# EAGLE design tc4-controller-02 (EAGLE 5.10)
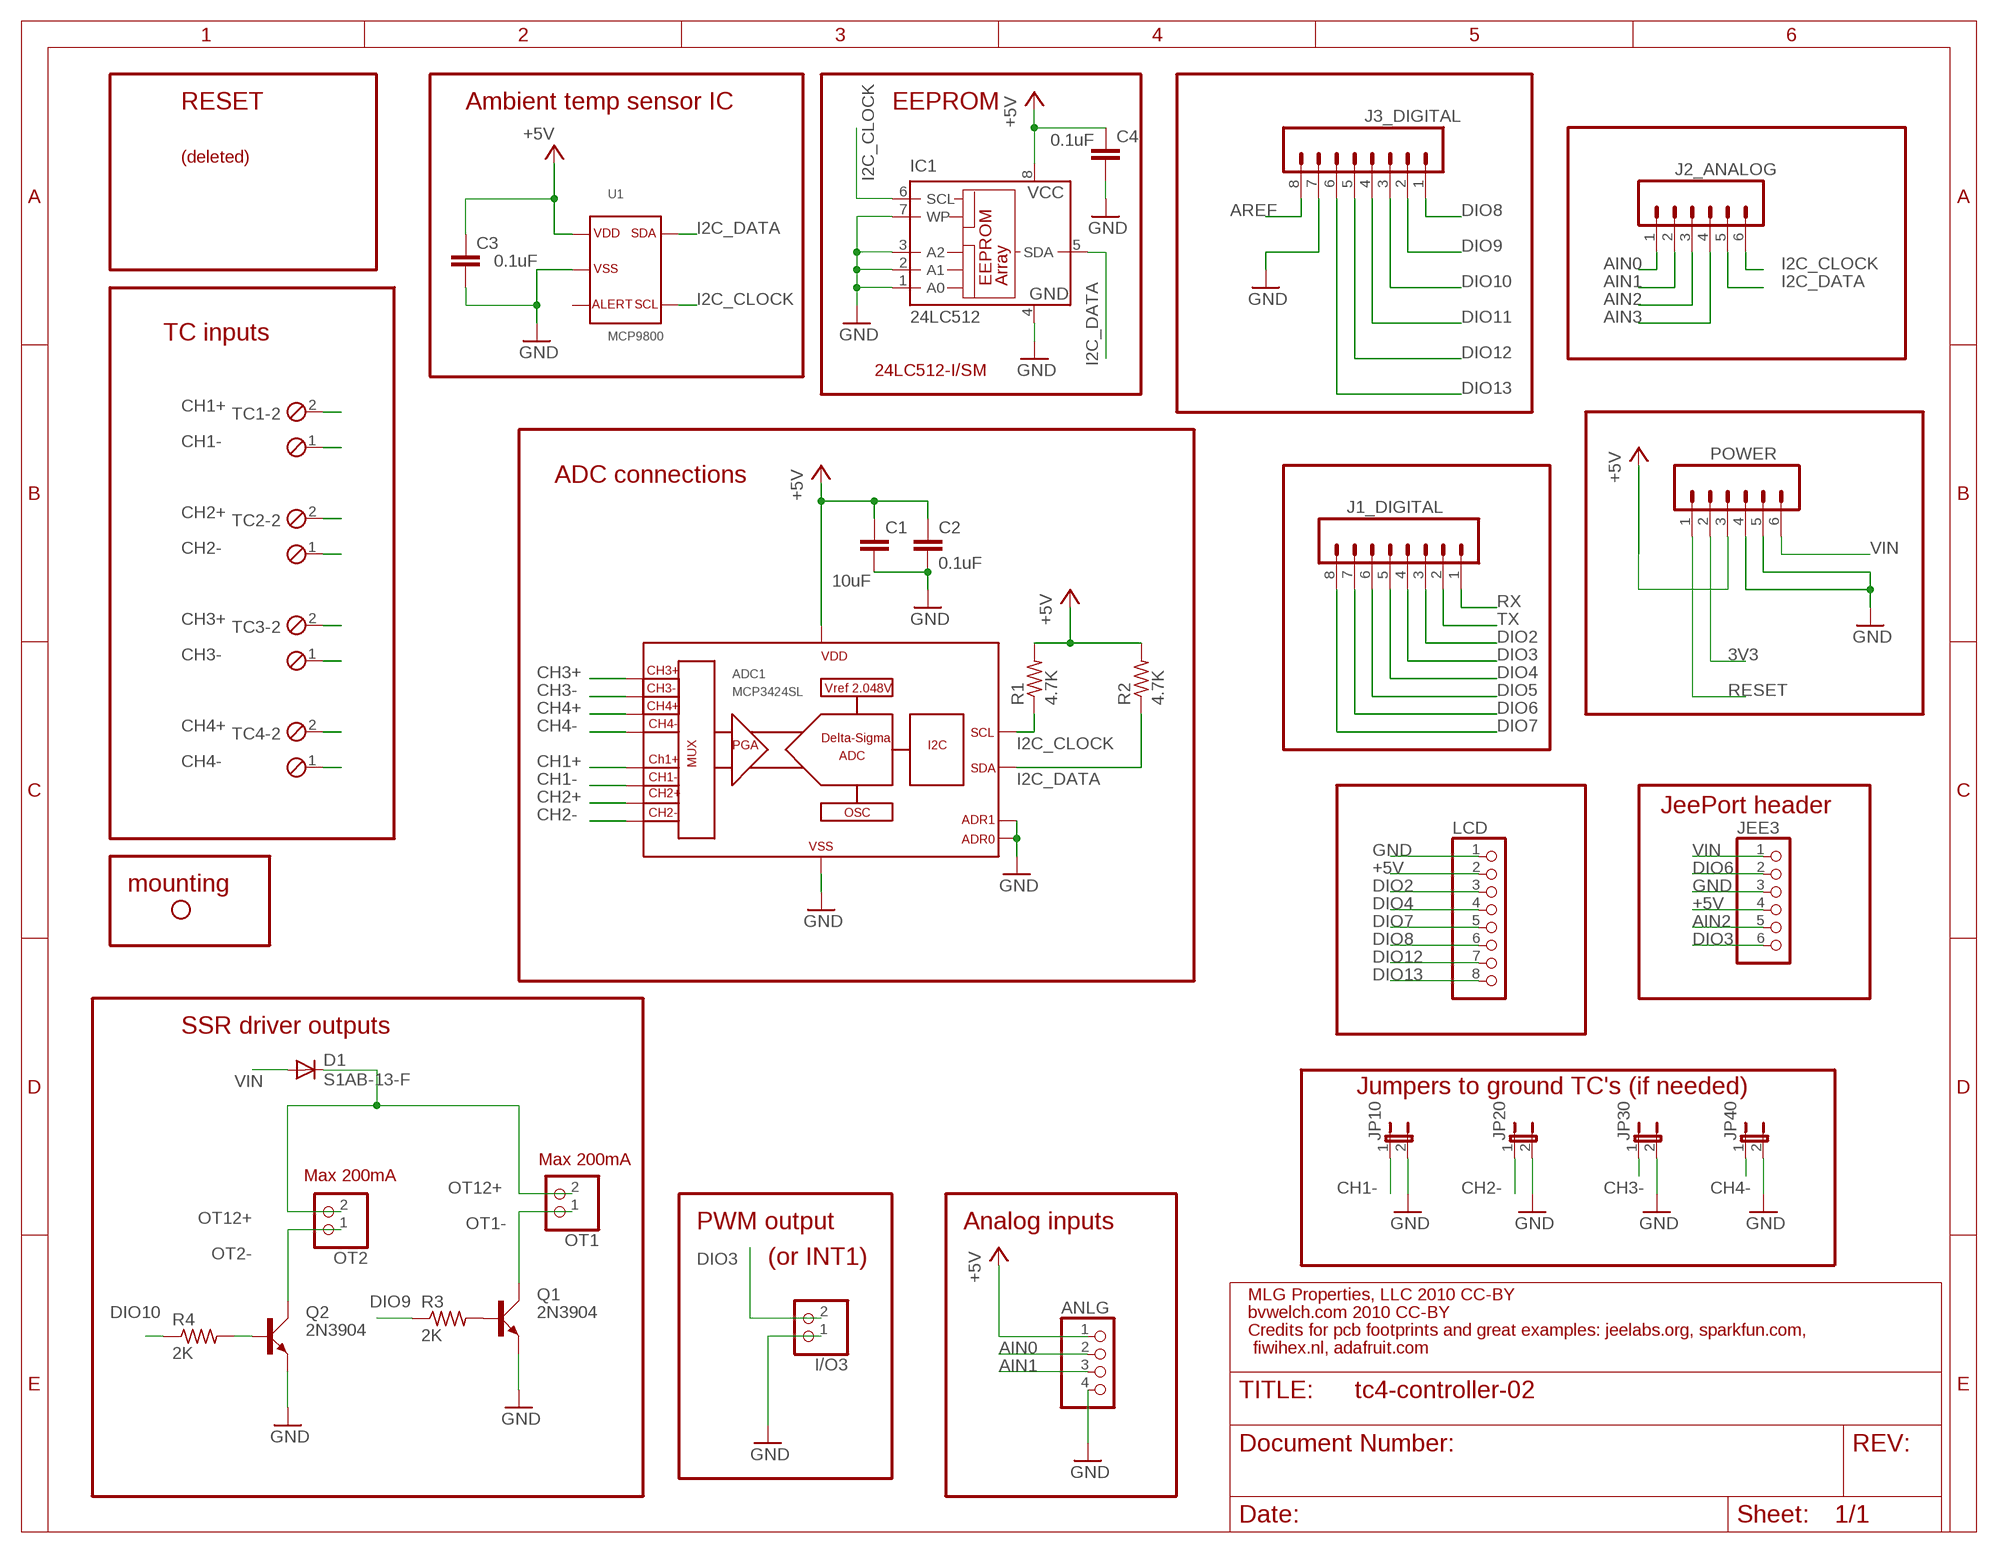
[diagram p0: schematic, sheet 1]

## Parts
ADC1  MCP3424SL  [SO14]
ANLG  PINHD-1X4  [1X04]
C1  10uF  C-EUC1206  [C1206]
C2  0.1uF  C-EU025-025X050  [C025-025X050]
C3  0.1uF  C-EU025-025X050  [C025-025X050]
C4  0.1uF  C-EUC1206  [C1206]
D1  S1AB-13-F  DIODE-DO214AA  [DO214AA]
I/O3  PINHD-1X2  [1X02]
IC1  24LC512  24LC128SM  [SO-08M]
J1_DIGITAL  M08  [1X08]
J2_ANALOG  M06SIP  [1X06]
J3_DIGITAL  M08  [1X08]
JEE3  PINHD-1X6  [1X06]
JP1  STAND-OFF  [STAND-OFF]
JP10  JP1E  [JP1]
JP20  JP1E  [JP1]
JP30  JP1E  [JP1]
JP40  JP1E  [JP1]
LCD  PINHD-1X8  [1X08]
OT1  PINHD-1X2  [1X02]
OT2  PINHD-1X2  [1X02]
POWER  M06SIP  [1X06]
Q1  2N3904  [TO92D]
Q2  2N3904  [TO92D]
R1  4.7K  R-US_0204/7  [0204/7]
R2  4.7K  R-US_0204/7  [0204/7]
R3  2K  R-US_R1206  [R1206]
R4  2K  R-US_R1206  [R1206]
TC1  MPT2  [2POL254]
TC2  MPT2  [2POL254]
TC3  MPT2  [2POL254]
TC4  MPT2  [2POL254]
U1  MCP9800  [SOT23-5L]

## Nets
3V3: POWER.2
+5V: ADC1.6 ANLG.1 C1.1 C2.1 C3.1 C4.1 IC1.8(VCC) JEE3.4 LCD.2 POWER.3 R1.2 R2.2 U1.1
AIN0: ANLG.2 J2_ANALOG.1
AIN1: ANLG.3 J2_ANALOG.2
AIN2: J2_ANALOG.3 JEE3.5
AIN3: J2_ANALOG.4
AREF: J3_DIGITAL.8
CH1+: ADC1.1 TC1.2
CH1-: ADC1.2 JP10.1 TC1.1
CH2+: ADC1.3 TC2.2
CH2-: ADC1.4 JP20.1 TC2.1
CH3+: ADC1.11 TC3.2
CH3-: ADC1.12 JP30.1 TC3.1
CH4+: ADC1.13 TC4.2
CH4-: ADC1.14 JP40.1 TC4.1
DIO2: J1_DIGITAL.3 LCD.3
DIO3: I/O3.2 J1_DIGITAL.4 JEE3.6
DIO4: J1_DIGITAL.5 LCD.4
DIO5: J1_DIGITAL.6
DIO6: J1_DIGITAL.7 JEE3.2
DIO7: J1_DIGITAL.8 LCD.5
DIO8: J3_DIGITAL.1 LCD.6
DIO9: J3_DIGITAL.2 R3.1
DIO10: J3_DIGITAL.3 R4.1
DIO11: J3_DIGITAL.4
DIO12: J3_DIGITAL.5 LCD.7
DIO13: J3_DIGITAL.6 LCD.8
GND: ADC1.5 ADC1.9 ADC1.10 ANLG.4 C1.2 C2.2 C3.2 C4.2 I/O3.1 IC1.1(A0) IC1.2(A1) IC1.3(A2) IC1.4(GND) IC1.7(WP) J3_DIGITAL.7 JEE3.3 JP10.2 JP20.2 JP30.2 JP40.2 LCD.1 POWER.4 POWER.5 Q1.E Q2.E U1.2
I2C_CLOCK: ADC1.8 IC1.6(SCL) J2_ANALOG.6 R1.1 U1.4
I2C_DATA: ADC1.7 IC1.5(SDA) J2_ANALOG.5 R2.1 U1.5
N$3: Q2.B R4.2
N$4: Q1.B R3.2
OT1-: OT1.1 Q1.C
OT2-: OT2.1 Q2.C
OT12+: D1.C OT1.2 OT2.2
RESET: POWER.1
RX: J1_DIGITAL.1
TX: J1_DIGITAL.2
VIN: D1.A JEE3.1 POWER.6
Unconnected: U1.3

## Notes on the sheet
- RESET | Ambient temp sensor IC | EEPROM
- (deleted)
- TC inputs
- 24LC512-I/SM
- ADC connections
- JeePort header
- mounting
- SSR driver outputs
- Jumpers to ground TC's (if needed)
- Max 200mA
- Max 200mA
- PWM output | Analog inputs
- (or INT1)
- MLG Properties, LLC 2010 CC-BY
- bvwelch.com 2010 CC-BY
- Credits for pcb footprints and great examples: jeelabs.org, sparkfun.com,
- fiwihex.nl, adafruit.com

## Library data of the parts
ADC1 = newparts_2010:MCP3424: 18-bit multi-channel delta-sigma AD converter with I2C interface. Microchip. Farnell 1630424
ANLG = pinhead:PINHD-1X4: PIN HEADER
C1-C4 = rcl:C-EU: CAPACITOR, European symbol
D1 = diode:DIODE-: DIODE
I/O3 OT1 OT2 = pinhead:PINHD-1X2: PIN HEADER
IC1 = microchip:24*: Serial EEPROM I2C
J1_DIGITAL J3_DIGITAL = SparkFun:M08: Header 8 Standard 8-pin 0.1" header. Use with straight break away headers (SKU : PRT-00116), right angle break away headers (PRT-00553), swiss pins (PRT-00743), machine pins (PRT-00117), and female headers (PRT-00115).
J2_ANALOG POWER = SparkFun:M06: Header 6 Standard 6-pin 0.1" header. Use with straight break away headers (SKU : PRT-00116), right angle break away headers (PRT-00553), swiss pins (PRT-00743), machine pins (PRT-00117), and female headers (PRT-00115). Molex polarized connector foot print use with SKU : PRT-08094 with associated crimp pins and housings. NOTES ON THE VARIANTS LOCK and LOCK_LONGPADS... This footprint was designed to help hold the alignment of a through-hole component (i.e. 6-pin header) while soldering it into place. You may notice that each hole has been shifted either up or down by 0.005 of an inch from it's more standard position (which is a perfectly straight line). This slight alteration caused the pins (the squares in the middle) to touch the edges of the holes. Because they are alternating, it causes a "brace" to hold the component in place. 0.005 has proven to be the perfect amount of "off-center" position when using our standard breakaway headers. Although looks a little odd when you look at the bare footprint, once you have a header in there, the alteration is very hard to notice. Also, if you push a header all the way into place, it is covered up entirely on the bottom side. This idea of altering the position of holes to aid alignment will be further integrated into the Sparkfun Library for other footprints. It can help hold any component with 3 or more connection pins.
JEE3 = pinhead:PINHD-1X6: PIN HEADER
JP1 = SparkFun:STAND-OFF: Stand Off This is the mechanical footprint for a #4 phillips button head screw. Use the keepout ring to avoid running the screw head into surrounding components. SKU : PRT-00447
JP10 JP20 JP30 JP40 = jumper:JP1E: JUMPER
LCD = pinhead:PINHD-1X8: PIN HEADER
Q1 Q2 = transistor-small-signal:2N3904: NPN TRANSISTOR
R1-R4 = rcl:R-US_: RESISTOR, American symbol
TC1-TC4 = newparts_2006:MPT2: PHOENIX CONNECTOR
U1 = newparts_2010:MCP9800: Temperature sensor I2C output, Microchip. Farnell 1439485

## Board
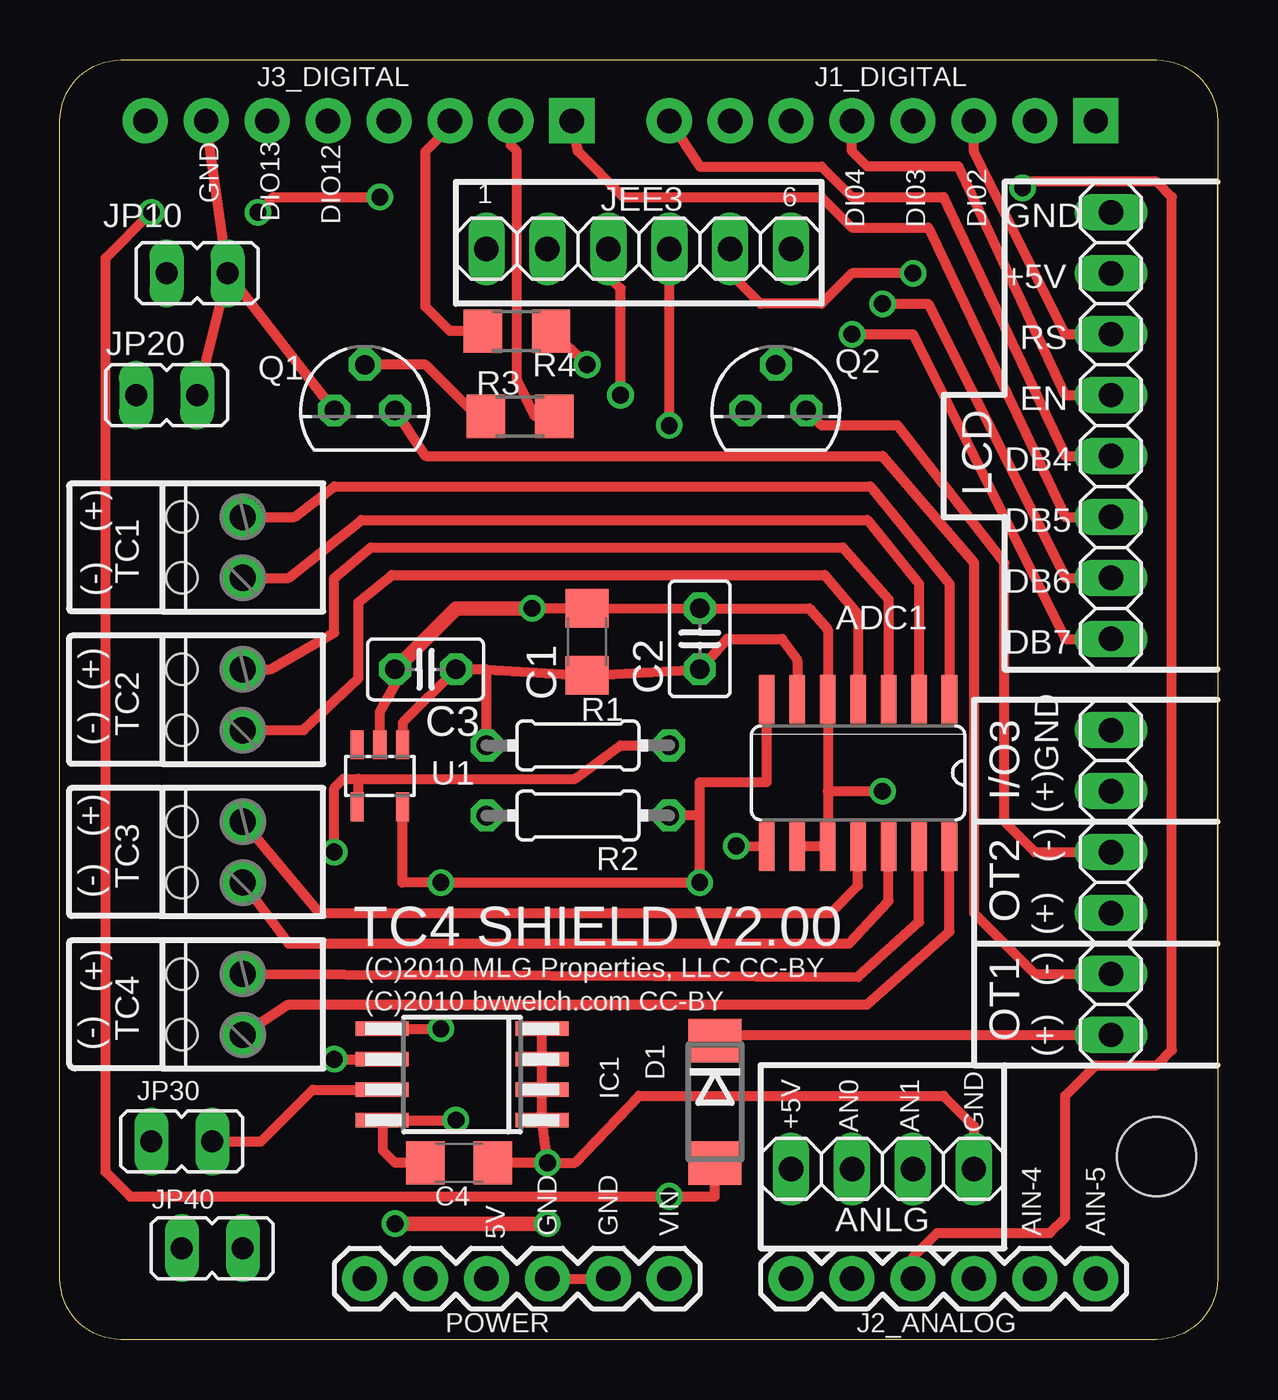
[diagram p1: board, top side]
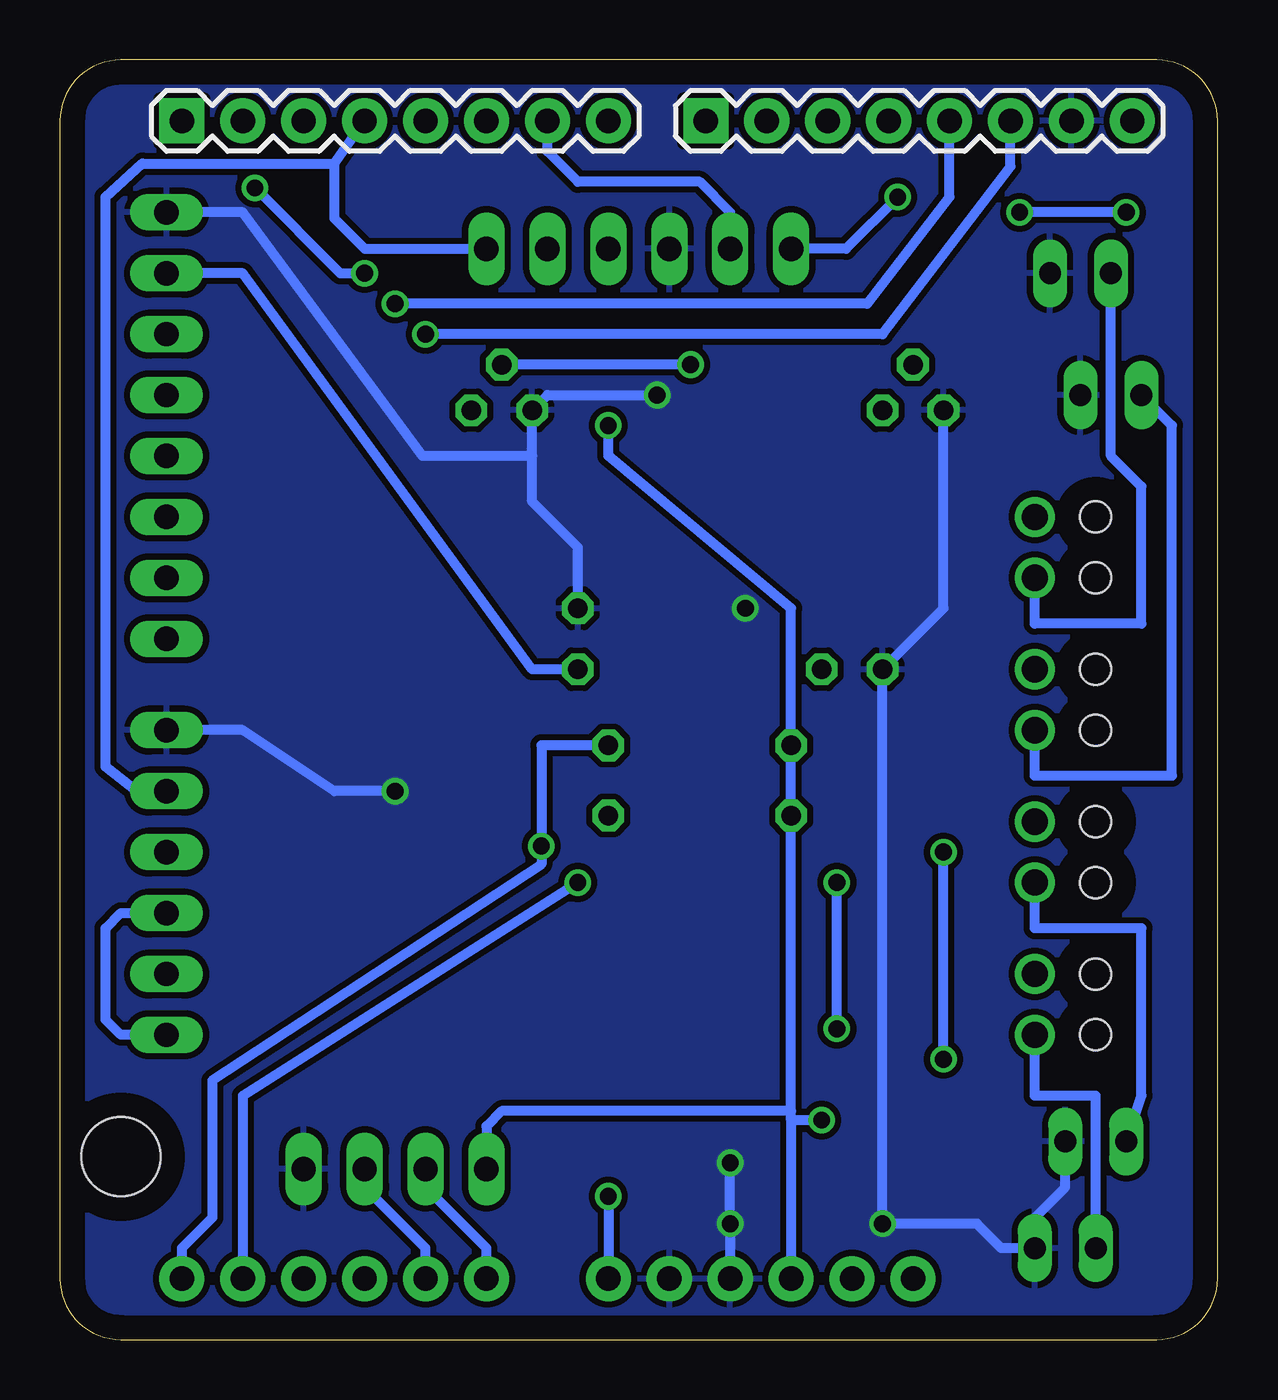
[diagram p2: board, bottom side, seen from below]

Size 48.26 x 53.34 mm. Coordinates in mm from the lower left corner, seen from the top.
Outline: 2.54,0 arc-90 0,2.54 0,50.8 arc-90 2.54,53.34 45.72,53.34 arc-90 48.26,50.8 48.26,2.54 arc-90 45.72,0 2.54,0
Copper layers (1*16): Top 0.035mm / dielectric 1.5mm / Bottom 0.035mm
Design rules "Olimex10mils": minimum track width 10mil, minimum drill 24mil, track to track 10mil, track to pad 10mil, pad to pad 10mil, via to via 10mil, smd to smd 10mil, copper to edge 40mil, drill to drill 10mil, minimum pad ring 10mil, minimum via ring 8mil, stop-mask expansion 0mil, vias tented up to drill 0mil, thermal gap 10mil

### Footprints (pad centres in the part's own frame; a part is rotated, then mirrored left to right if it is on the bottom)
SO14 = smd 0.66 x 2.032: 1 -3.81,-3.073; 2 -2.54,-3.073; 3 -1.27,-3.073; 4 0,-3.073; 5 1.27,-3.073; 6 2.54,-3.073; 7 3.81,-3.073; 8 3.81,3.073; 9 2.54,3.073; 10 1.27,3.073; 11 0,3.073; 12 -1.27,3.073; 13 -2.54,3.073; 14 -3.81,3.073
1X04 = drill 1.016 long: 1 -3.81,0; 2 -1.27,0; 3 1.27,0; 4 3.81,0
C1206 = smd 1.6 x 1.8: 1 -1.4,0; 2 1.4,0
C025-025X050 = drill 0.813 octagon: 1 -1.27,0; 2 1.27,0
DO214AA = smd 1.8 x 2.2: A 2.55,0; C -2.55,0
1X02 = drill 1.016 long: 1 -1.27,0; 2 1.27,0
SO-08M = smd 0.6 x 2.2: 1 -1.905,-3.33; 2 -0.635,-3.33; 3 0.635,-3.33; 4 1.905,-3.33; 5 1.905,3.33; 6 0.635,3.33; 7 -0.635,3.33; 8 -1.905,3.33
1X08 = drill 1.016 pad 1.88 square: 1 0,0 | drill 1.016 pad 1.88 round: 2 2.54,0; 3 5.08,0; 4 7.62,0; 5 10.16,0; 6 12.7,0; 7 15.24,0; 8 17.78,0
1X06 = drill 1.016 pad 1.88 round: 1 0,0; 2 2.54,0; 3 5.08,0; 4 7.62,0; 5 10.16,0; 6 12.7,0
1X06' = drill 1.016 long: 1 -6.35,0; 2 -3.81,0; 3 -1.27,0; 4 1.27,0; 5 3.81,0; 6 6.35,0
STAND-OFF = hole 3.302: 0,0
JP1 = drill 0.914 long: 1 0,-1.27; 2 0,1.27
1X08' = drill 1.016 long: 1 -8.89,0; 2 -6.35,0; 3 -3.81,0; 4 -1.27,0; 5 1.27,0; 6 3.81,0; 7 6.35,0; 8 8.89,0
TO92D = drill 0.813 octagon: B 0,1.905; C 1.27,0; E -1.27,0
0204/7 = drill 0.813 octagon: 1 -3.81,0; 2 3.81,0
R1206 = smd 1.6 x 1.803: 1 -1.422,0; 2 1.422,0
2POL254 = drill 1.092 pad 1.676 round: 1 -1.27,0; 2 1.27,0 | hole 1.295: -1.27,2.54; 1.27,2.54
SOT23-5L = smd 0.55 x 1.2: 1 -0.95,-1.3; 2 0,-1.3; 3 0.95,-1.3; 4 0.95,1.3; 5 -0.95,1.3

### Placement (x,y rotation side)
ADC1  33.27,23.62 180 top
ANLG  34.29,7.11 0 top
C1  21.97,29.08 90 top
C2  26.67,29.21 90 top
C3  15.24,27.94 180 top
C4  16.64,7.37 0 top
D1  27.3,9.91 270 top
I/O3  43.82,24.13 270 top
IC1  16.76,11.05 90 top
J1_DIGITAL  43.18,50.8 0 bottom
J2_ANALOG  30.48,2.54 0 top
J3_DIGITAL  21.34,50.8 0 bottom
JEE3  [1X06']  24.13,45.47 0 top
JP1  45.72,7.62 180 top
JP10  5.71,44.45 270 top
JP20  4.45,39.37 270 top
JP30  5.08,8.26 270 top
JP40  6.35,3.81 270 top
LCD  [1X08']  43.82,38.1 270 top
OT1  43.82,13.97 270 top
OT2  43.82,19.05 270 top
POWER  12.7,2.54 0 top
Q1  12.7,38.73 0 top
Q2  29.84,38.73 0 top
R1  21.59,24.77 180 top
R2  21.59,21.84 180 top
R3  19.18,38.48 180 top
R4  19.05,42.04 0 top
TC1  7.62,33.02 90 top
TC2  7.62,26.67 90 top
TC3  7.62,20.32 90 top
TC4  7.62,13.97 90 top
U1  13.34,23.5 180 top

### Tracks (layer width: path | path; a pad name or v marks a point on that pad's centre or on a via)
+5V  (via drill 0.7)
  Top 0.406: U1.1 14.28,25.71 C3.1 17.78,27.94 | 17.78,27.94 C1.1 C2.1 27.81,29.21 30.1,29.21 30.73,28.32 ADC1.6 | R1.2 17.78,27.94 | v25.4,38.1 JEE3.4 | v16.51,9.14 IC1.8 13.46,9.12 13.46,7.87 13.97,7.37 C4.1
  Bottom 0.406: 17.78,9.14 POWER.3 | 17.78,9.14 17.78,9.53 | LCD.2 40.64,44.45 28.58,27.94 C2.1 | 17.78,9.53 29.84,9.53 30.48,8.89 ANLG.1 | v25.4,38.1 25.4,36.83 17.78,30.48 R1.2 R2.2 17.78,9.53 | v16.51,9.14 17.78,9.14
AIN0
  Bottom 0.406: J2_ANALOG.1 30.48,3.81 33.02,6.35 ANLG.2
AIN1
  Bottom 0.406: J2_ANALOG.2 33.02,3.81 35.56,6.35 ANLG.3
AIN2  (via drill 0.7)
  Top 0.406: JEE3.5 27.94,44.45 29.21,43.18 31.75,43.18 33.02,44.45 v35.56,44.45 | J2_ANALOG.3 35.56,3.43 36.58,4.45 41.27,4.45 41.91,5.08 41.91,10.16 43.18,11.43 45.72,11.43 46.35,12.06 46.35,47.62 45.72,48.26 40.39,48.26 v40.13,48.01
  Bottom 0.406: v40.13,48.01 36.58,44.45 v35.56,44.45
CH1+
  Top 0.406: ADC1.1 37.08,31.5 33.78,35.56 11.43,35.56 9.78,34.29 TC1.2
CH1-
  Top 0.406: TC1.1 9.52,31.75 12.57,34.16 33.66,34.16 35.81,31.5 ADC1.2
  Bottom 0.406: JP10.1 4.45,36.83 3.18,35.56 3.18,29.84 7.62,29.84 TC1.1
CH2+
  Top 0.406: ADC1.3 34.54,30.86 32.64,33.02 12.95,33.02 11.43,31.75 11.43,29.46 8.76,27.94 TC2.2
CH2-
  Top 0.406: TC2.1 10.16,25.4 12.45,27.56 12.45,30.73 13.84,31.88 31.88,31.88 33.27,30.23 ADC1.4
  Bottom 0.406: TC2.1 7.62,23.5 1.91,23.5 1.91,38.1 JP20.1
CH3+
  Top 0.406: TC3.2 10.79,17.78 32.13,17.78 33.27,18.92 ADC1.11
CH3-
  Top 0.406: 7.88,18.79 TC3.1 9.52,16.51 32.89,16.51 34.54,18.29 ADC1.12
  Bottom 0.406: TC3.1 7.62,17.14 3.18,17.14 3.18,10.16 JP30.1
CH4+
  Top 0.406: ADC1.13 35.81,17.4 33.27,15.11 TC4.2
CH4-
  Top 0.406: ADC1.14 37.08,16.99 33.66,13.97 9.52,13.97 TC4.1
  Bottom 0.406: JP40.1 5.08,10.16 7.62,10.16 TC4.1
DIO2
  Top 0.406: J1_DIGITAL.3 38.1,49.53 41.91,41.91 LCD.3
DIO3
  Bottom 0.406: 36.83,49.02 44.83,49.02 46.35,47.62 46.35,23.88 45.09,22.86 I/O3.2 | 36.83,49.02 J1_DIGITAL.4 | 36.83,49.02 36.83,46.74 35.56,45.47 JEE3.6
DIO4
  Top 0.406: LCD.4 41.91,39.37 37.46,48.9 33.66,48.9 33.02,49.53 J1_DIGITAL.5
DIO6
  Bottom 0.406: J1_DIGITAL.7 27.94,49.53 26.67,48.26 21.59,48.26 20.32,46.99 JEE3.2
DIO7
  Top 0.406: LCD.5 41.91,36.83 36.83,47.62 33.02,47.62 31.75,48.9 26.67,48.9 J1_DIGITAL.8
DIO8
  Top 0.406: LCD.6 41.91,34.29 36.2,46.35 33.02,46.35 31.75,47.62 23.49,47.62 21.59,49.53 J3_DIGITAL.1
DIO9
  Top 0.406: J3_DIGITAL.2 18.8,49.78 19.05,49.53 19.05,40.01 19.81,38.48 R3.1
DIO10
  Top 0.406: J3_DIGITAL.3 16.26,50.55 15.24,49.53 15.24,43.05 16.26,42.04 R4.1
DIO12  (via drill 0.7)
  Top 0.406: LCD.7 41.91,31.75 36.2,43.18 v34.29,43.18
  Bottom 0.406: J3_DIGITAL.5 11.18,47.62 14.6,43.18 v34.29,43.18
DIO13  (via drill 0.7)
  Top 0.406: LCD.8 41.91,29.21 35.56,41.91 v33.02,41.91
  Bottom 0.406: J3_DIGITAL.6 8.64,48.9 13.97,41.91 v33.02,41.91
GND  (via drill 0.7)
  Top 0.406: POWER.4 POWER.5 | U1.2 13.34,26.16 13.97,27.3 C3.2 | JP10.2 JP20.2 | Q1.E JP10.2 | ADC1.9 ADC1.10 32,22.86 | 32,22.86 ADC1.5 32,29.59 31.24,30.48 C2.2 C1.2 v19.69,30.48 | JP10.2 J3_DIGITAL.7 | 32,22.86 v34.29,22.86 | JEE3.3 22.86,44.32 23.37,43.81 v23.37,39.37 | IC1.4 IC1.3 IC1.2 IC1.1 v20.32,7.37 | JP30.2 8.38,8.26 10.54,10.41 IC1.7 | ANLG.4 38.1,8.89 36.83,10.16 24.13,10.16 21.46,7.37 v20.32,7.37 | v20.32,7.37 C4.2
  Top 0.61: C3.2 16.51,30.48 v19.69,30.48 | v13.97,4.83 v20.32,4.83
  Bottom 0.406: LCD.1 40.64,46.99 33.15,36.83 28.58,36.83 | I/O3.1 40.64,25.4 36.83,22.86 v34.29,22.86 | v23.37,39.37 27.94,39.37 Q2.E 28.58,36.83 | JP30.2 6.35,6.35 7.62,5.08 JP40.2 9.02,3.81 10.03,4.83 v13.97,4.83 C3.2 11.43,30.48 Q1.E | POWER.4 v20.32,4.83 v20.32,7.37 | 28.58,36.83 28.58,34.92 26.67,33.02 C2.2
  pour Bottom: 47.62,50.8 arc90 45.72,52.7 2.54,52.7 arc90 0.63,50.8 0.63,2.54 arc90 2.54,0.64 46.35,0.64 arc90 47.62,2.54
I2C_CLOCK  (via drill 0.7)
  Top 0.406: v28.19,20.57 ADC1.8 | R1.1 23.37,24.77 21.46,23.37 12.45,23.37 | 12.45,23.37 U1.4 | v11.43,11.68 IC1.6 | v11.43,20.32 11.43,22.99 11.81,23.37 12.45,23.37
  Bottom 0.406: R1.1 28.19,24.77 v28.19,20.57 28.19,19.81 41.91,10.79 41.91,5.08 43.18,3.81 J2_ANALOG.6 | v11.43,11.68 v11.43,20.32
I2C_DATA  (via drill 0.7)
  Top 0.406: U1.5 14.28,21.67 14.27,21.67 14.27,19.05 v15.88,19.05 v26.67,19.05 26.67,21.84 | ADC1.7 29.46,23.24 26.67,23.24 26.67,21.84 | 26.67,21.84 R2.1 | IC1.5 v15.88,12.95
  Bottom 0.406: v26.67,19.05 40.64,10.16 J2_ANALOG.5 | v15.88,12.95 v15.88,19.05
N$3  (via drill 0.7)
  Top 0.406: R4.2 v21.97,40.64
  Bottom 0.406: v21.97,40.64 Q2.B
N$4
  Top 0.406: R3.2 17.4,38.48 15.24,40.64 Q1.B
OT1-
  Top 0.406: Q1.C 15.24,36.83 34.29,36.83 38.1,32.38 38.1,17.78 40.64,15.24 OT1.1
OT2-
  Top 0.406: Q2.C 31.75,38.1 34.92,38.1 39.37,32.38 39.37,21.59 40.64,20.32 OT2.1
OT12+
  Top 0.406: 27.05,12.7 OT1.2
  Top 0.61: D1.C 27.05,12.7
  Bottom 0.406: OT2.2 45.72,17.78 46.35,17.14 46.35,13.34 45.72,12.7 OT1.2
VIN  (via drill 0.7)
  Top 0.406: v13.34,47.62 8.89,47.62 v8.25,46.99 | v3.81,46.99 1.91,45.09 1.91,6.99 2.92,5.97 v25.4,5.97 27.3,5.97 D1.A
  Bottom 0.406: JEE3.1 15.49,45.47 v13.34,47.62 | v3.81,46.99 v8.25,46.99 | v25.4,5.97 POWER.6

### Text on the board
tNames: GND | DIO13 | 1 | 6 | DIO12 | DI04 | DI03 | DI02 | GND | +5V | RS | EN | DB4 | (+) | DB5 | (-) | DB6 | DB7 | (+) | (-) | GND | (+) | (+) | (-) | (-) | (+) | TC4 SHIELD V2.00 | (C)2010 MLG Properties, LLC CC-BY | (-) | (+) | (C)2010 bvwelch.com CC-BY | (-) | (+) | +5V | AN0 | AN1 | GND | 5V | GND | GND | VIN | AIN-4 | AIN-5